# EasyEDA Pro project ProPrj_WashMech_V2.0_C011F6P6_2026-03-09.epro

# Schematic Schematic1
Assembly Variant: Basic; Board Name: Board1; Create Date: 2026-03-09; Page Name: P1; Project Name: WashMech_V2.0_C011F6P6; Schematic Name: Schematic1; Update Date: 2026-03-09; BladeWidth: 10; Company: 嘉立创EDA; Page Size: A4; RegionStart: 1; ShowBorder: 1; TitleBlock: 1; TitleBlockPosition: 3; Version: V1.0; XRegionCount: 6; YRegionCount: 4
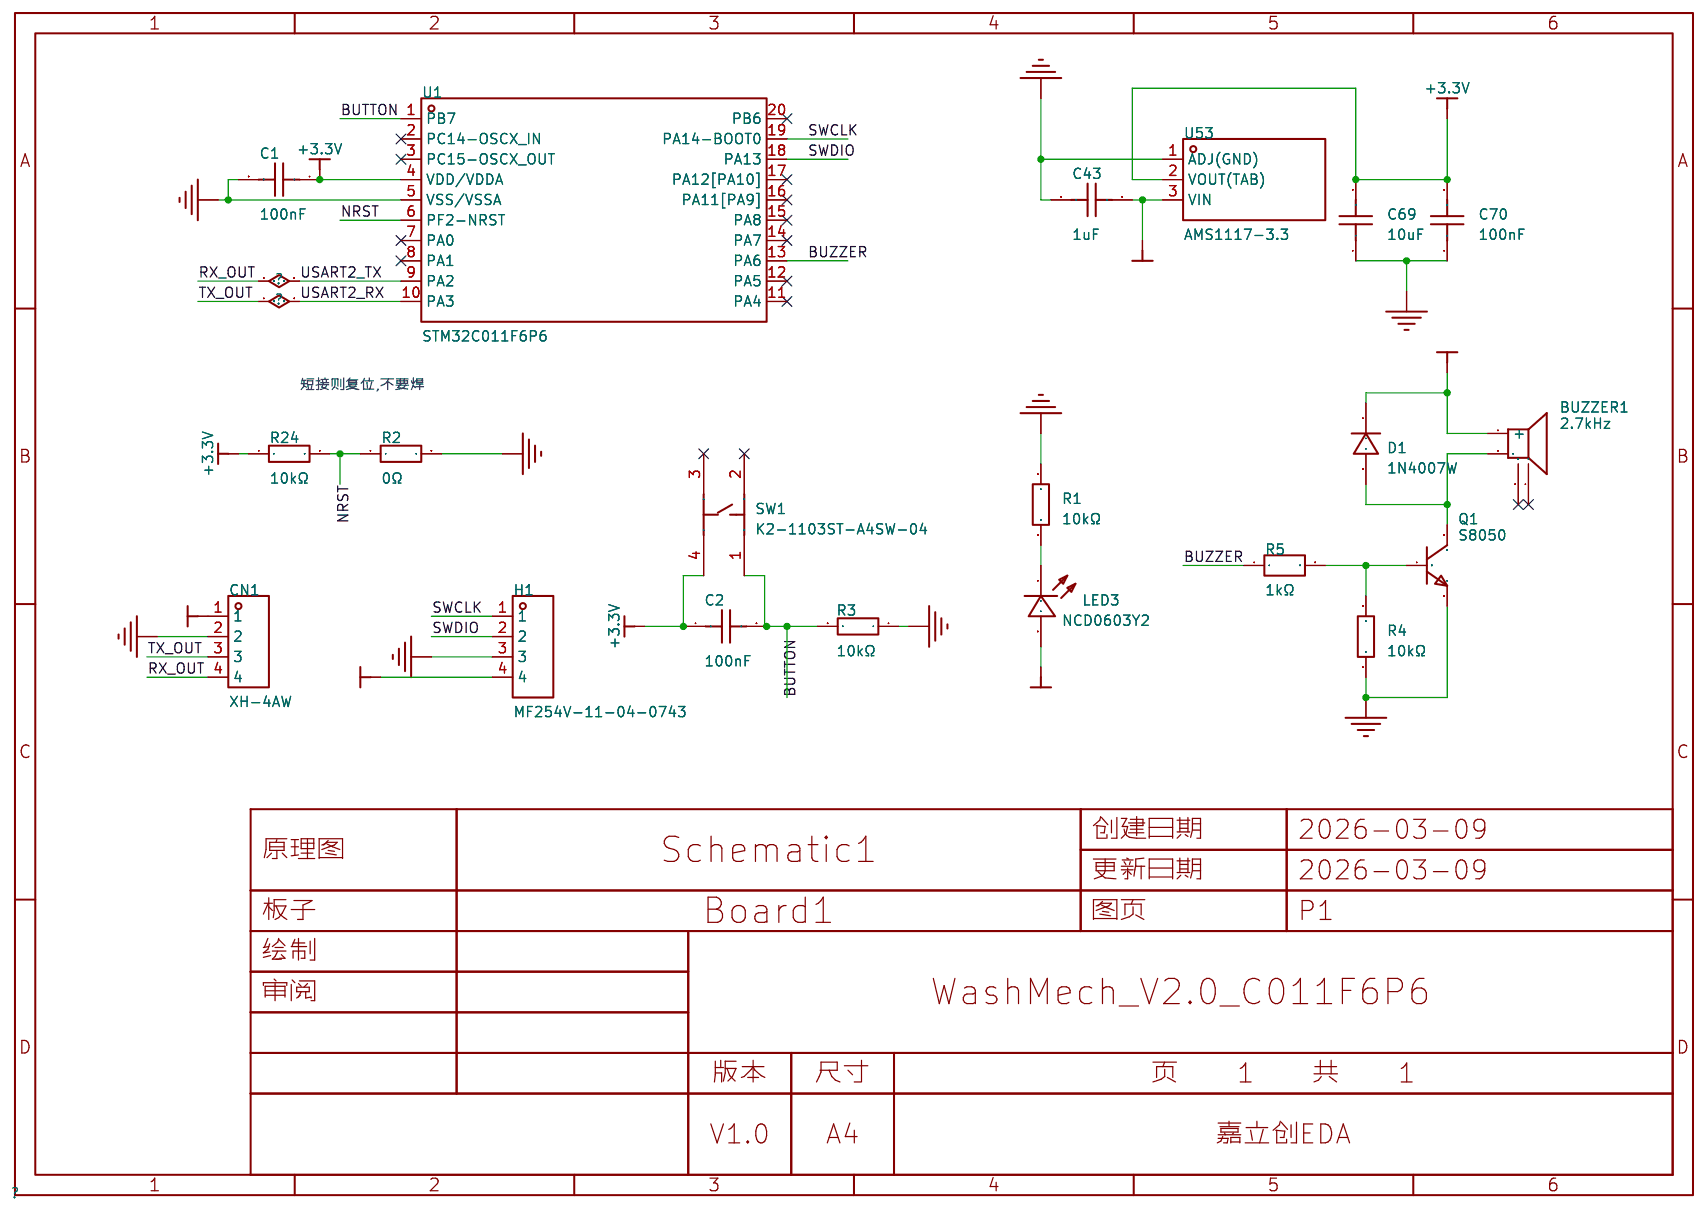
[diagram p0: schematic sheet]

## Parts
BUZZER1  2.7kHz  [BUZ-SMD_4P-L8.5-W8.5-P8.50-BR]
C1  100nF  [C0603]
C2  100nF  [C0603]
C43  1uF  [C0603]
C69  10uF  [C0603]
C70  100nF  [C0603]
CN1  XH-4AW  [CONN-TH_XH-4AW]
D1  1N4007W  [SOD-123FL_L2.7-W1.8-LS3.8-RD]
H1  MF254V-11-04-0743  [HDR-TH_4P-P2.54-V-F_MF254V-11-04-0743]
LED3  NCD0603Y2  [LED0603-RD]
Q1  S8050  [SOT-23-3_L2.9-W1.3-P1.90-LS2.3-BR]
R1  10kΩ  [R0603]
R2  0Ω  [R0603]
R3  10kΩ  [R0603]
R4  10kΩ  [R0603]
R5  1kΩ  [R0603]
R24  10kΩ  [R0603]
SW1  K2-1103ST-A4SW-04  [KEY-SMD_4P-L12.0-W12.0-P5.00-LS15.1_K2-1103ST-A4SW-04]
U1  STM32C011F6P6  [TSSOP-20_L6.5-W4.4-P0.65-LS6.4-BL]
U53  AMS1117-3.3  [SOT-89_L4.5-W2.5-P1.50-LS4.2-BR]

## Library data of the parts
BUZZER1 = MLT-8530_C94599: 驱动方式:无源(外部驱动);构造类型:电磁式;额定电压:3.6V;频率:2.7kHz;声压(SPL):80dB;; LCSC Part Name: 无源(外部驱动) 电磁式 2.7kHz; Supplier Part: C94599; Manufacturer: 华能; Manufacturer Part: MLT-8530; Supplier Footprint: SMD,8.5x8.5mm; JLCPCB Part Class: Extended Part; Datasheet: https://item.szlcsc.com/datasheet/MLT-8530/95797.html; Supplier: LCSC; Driver Circuitry: 无源(外部驱动); Technology: 电磁式; Voltage Rating: 3.6V; Voltage - Supply: 2.5V~4.5V; Current Consumption: 95mA; Sound Pressure Level(SPL): 80dB; Length: 8.5mm; Width: 8.5mm; Height: 3.3mm; Operating Temperature: -20℃~+70℃; Mounting Type: 贴片
C1 C2 C70 = CC0603KRX7R9BB104: 容值:100nF;精度:±10%;额定电压:50V;材质(温度系数):X7R;; LCSC Part Name: 100nF ±10% 50V; Supplier Part: C14663; Manufacturer: YAGEO(国巨); Supplier Footprint: 0603; JLCPCB Part Class: 基础库; Datasheet: https://atta.szlcsc.com/upload/public/pdf/source/20180910/C282072_33301C7F631E79921B82A8DAC6BCC5B3.pdf; Supplier: LCSC; Tolerance: ±10%; Voltage Rated: 50V; Temperature Coefficient: X7R
C43 = CL10A105KB8NNNC: 容值:1uF;精度:±10%;额定电压:50V;材质(温度系数):X5R;; LCSC Part Name: 1uF ±10% 50V; Supplier Part: C15849; Manufacturer: SAMSUNG(三星); Supplier Footprint: 0603; JLCPCB Part Class: 基础库; Datasheet: https://atta.szlcsc.com/upload/public/pdf/source/20160218/1457707763339.pdf; Supplier: LCSC; Tolerance: ±10%; Voltage Rated: 50V; Temperature Coefficient: X5R
C69 = CGA0603X5R106K100JT: 容值:10uF;精度:±10%;额定电压:10V;材质(温度系数):X5R;; LCSC Part Name: 10uF ±10% 10V; Supplier Part: C6119842; Manufacturer: HRE(芯声); Supplier Footprint: 0603; JLCPCB Part Class: 扩展库; Datasheet: https://item.szlcsc.com/datasheet/CGA0603X5R106K100JT/7062548.html; Supplier: LCSC; Tolerance: ±10%; Voltage Rating: 10V; Temperature Coefficient: X5R; Voltage Rated: 10V
CN1 = XH-4AW: 插针结构:1x4P;间距:2.54mm;安装方式:弯插;参考系列:XH;总PIN数:4P;排数:1;每排PIN数:4;行距:-;额定电流:3A;触头材质:黄铜;触头镀层:锡;工作温度:-25℃~+85℃;; LCSC Part Name: 1x4P 间距:2.54mm 弯插 系列:XH; Supplier Part: C2908613; Manufacturer: HCTL(华灿天禄); Supplier Footprint: 弯插,P=2.5mm; JLCPCB Part Class: Extended Part; Datasheet: https://item.szlcsc.com/datasheet/XH-4AW/3184384.html; Supplier: LCSC; Pins Structure: 1x4P; Pitch: 2.54mm; Mounting Type: 弯插; Reference Series: XH; Number of Pins: 4P; Number of Rows: 1; Number of PINs Per Row: 4; Current Rating: 3A; Contact Material: 黄铜; Contact Plating: 锡; Operating Temperature: -25℃~+85℃; Voltage Rating: 250V; Plastic Material: PA66; Flame Retardant Rating: UL94V-0; Z-Height of the Board: 5.9mm; Y-Width of Bottom Edge on Board: 7mm
D1 = 1N4007W_C18199088: 二极管配置:独立式;正向压降(Vf):1V@1.0A;直流反向耐压(Vr):1kV;整流电流:1A;; LCSC Part Name: 1kV 1A; Supplier Part: C18199088; Manufacturer: R+O(宏嘉诚); Supplier Footprint: SOD-123FL; JLCPCB Part Class: Extended Part; Datasheet: https://item.szlcsc.com/datasheet/1N4007W/19354320.html; Supplier: LCSC; Diode Configuration: 独立式; Voltage - Forward(Vf@If): 1V@1.0A; Voltage - DC Reverse(Vr): 1kV; Current - Rectified: 1A; Reverse Leakage Current (Ir): 2uA@1000V; Non-Repetitive Peak Forward Surge Current: 30A; Operating Junction Temperature Range: -55℃~+150℃
H1 = MF254V-11-04-0743: 插孔结构:1x4P;间距:2.54mm;行距:-;圆孔/方孔:圆孔;安装方式:直插;排数:单排;总孔位数:4P;额定电流:3A;额定电压:-;插孔方向:顶部;塑高:3mm;工作温度:-40℃~+105℃;; LCSC Part Name: 间距:2.54mm 1x4P 直插; Supplier Part: C2889986; Manufacturer: XFCN(兴飞); Supplier Footprint: 插件,P=2.54mm; JLCPCB Part Class: Extended Part; Datasheet: https://item.szlcsc.com/datasheet/MF254V-11-04-0743/3112799.html; Supplier: LCSC; Holes Structure: 1x4P; Pitch: 2.54mm; Circular Hole / Square Hole: 圆孔; Mounting Type: 直插; Number of Rows: 单排; Number of Positions: 4P; Current Rating: 3A; Holes Direction: 顶部; Insulation Height: 3mm; Operating Temperature: -40℃~+105℃
LED3 = NCD0603Y2: 发光颜色:黄色;正向电压(VF):1.6V~2.6V;功率:65mW;正向电流:20mA;主波长:586nm~595nm;透镜颜色:无色透明透镜;发光强度:100mcd~220mcd;发光角度:130°;工作温度:-30℃~+85℃;; Supplier Part: C89811; Manufacturer: 国星光电; Supplier Footprint: 0603; JLCPCB Part Class: 扩展库; Datasheet: https://atta.szlcsc.com/upload/public/pdf/source/20200820/C89811_7FE84B429B6BCA3E113B125EE1452576.pdf; Supplier: LCSC; Emitted Color: 黄色; Forward Voltage (VF): 1.6V~2.6V; Power Dissipation: 65mW; Forward Current: 20mA; Dominant Wavelength: 586nm~595nm; Lens Color: 无色透明透镜; Luminous Intensity: 100mcd~220mcd; Viewing Angle: 130°; Operating Temperature: -30℃~+85℃
Q1 = S8050_C20069125: 晶体管类型:NPN;集电极电流(Ic):500mA;集射极击穿电压(Vceo):25V;耗散功率(Pd):300mW;直流电流增益(hFE):120@50mA,1.0V;; LCSC Part Name: hFE:200-350，丝印:J3Y NPN 500mA 25V; Supplier Part: C20069125; Manufacturer: R+O(宏嘉诚); Supplier Footprint: SOT-23; JLCPCB Part Class: Extended Part; Datasheet: https://item.szlcsc.com/datasheet/S8050/21397163.html; Supplier: LCSC; type: NPN; Current - Collector(Ic): 500mA; Collector - Emitter Voltage VCEO: 25V; Pd - Power Dissipation: 300mW; DC Current Gain: 120@50mA,1.0V; Transition frequency(fT): 100MHz; Current - Collector Cutoff: 100nA; Vce Saturation(VCE(sat)): 600mV@500mA,50mA; Operating Temperature: -55℃~+150℃; Emitter-Base Voltage(Vebo): 5V
R1 R3 R24 = 0603WAF1002T5E: 电阻类型:厚膜电阻;阻值:10kΩ;精度:±1%;功率:100mW;最大工作电压:75V;温度系数:±100ppm/℃;; LCSC Part Name: 厚膜电阻 10kΩ ±1% 100mW; Supplier Part: C25804; Manufacturer: UNI-ROYAL(厚声); Supplier Footprint: 0603; JLCPCB Part Class: Basic Part; Datasheet: https://atta.szlcsc.com/upload/public/pdf/source/20200306/C422600_1E6D84923E4A46A82E41ADD87F860B5C.pdf; Supplier: LCSC; Type: 厚膜电阻; Tolerance: ±1%; Power(Watts): 100mW; Voltage-Supply(Max): 75V; Temperature Coefficient: ±100ppm/℃; Operating Temperature: -55℃~+155℃; Overload Voltage (Max): 75V; Operating Temperature Range: -55℃~+155℃
R2 = RC0603FR-070RL: 电阻类型:厚膜电阻;阻值:0Ω;精度:±1%;功率:100mW;工作电压:75V;温度系数:-;; LCSC Part Name: 厚膜电阻 0Ω ±1% 100mW; Supplier Part: C100044; Manufacturer: YAGEO(国巨); Supplier Footprint: 0603; JLCPCB Part Class: Extended Part; Datasheet: https://item.szlcsc.com/datasheet/RC0603FR-070RL/101258.html; Supplier: LCSC; Type: 厚膜电阻; Tolerance: ±1%; Power(Watts): 100mW; Voltage-Supply(Max): 75V; Operating Temperature: -55℃~+155℃
R4 = 0603WAF1002T5E: 电阻类型:厚膜电阻;阻值:10kΩ;精度:±1%;功率:100mW;工作电压:75V;温度系数:±100ppm/℃;; LCSC Part Name: 厚膜电阻 10kΩ ±1% 100mW; Supplier Part: C25804; Manufacturer: UNI-ROYAL(厚声); Supplier Footprint: 0603; JLCPCB Part Class: Basic Part; Datasheet: https://item.szlcsc.com/datasheet/0603WAF1002T5E/26547.html; Supplier: LCSC; Type: 厚膜电阻; Tolerance: ±1%; Power(Watts): 100mW; Voltage-Supply(Max): 75V; Temperature Coefficient: ±100ppm/℃; Operating Temperature: -55℃~+155℃
R5 = FRC0603F1001TS: 电阻类型:厚膜电阻;阻值:1kΩ;精度:±1%;功率:100mW;工作电压:75V;温度系数:±100ppm/℃;; LCSC Part Name: 1kΩ ±1% 100mW 厚膜电阻; Supplier Part: C2907002; Manufacturer: FOJAN(富捷); Supplier Footprint: 0603; JLCPCB Part Class: Extended Part; Supplier: LCSC; Type: 厚膜电阻; Tolerance: ±1%; Power(Watts): 100mW; Voltage-Supply(Max): 75V; Temperature Coefficient: ±100ppm/℃; Operating Temperature: -55℃~+155℃
SW1 = K2-1103ST-A4SW-04: 电路结构:单刀单掷;按钮形状:矩形按钮;作用力:2.5N;安装方式:立贴;开关长度:12mm;开关宽度:12mm;开关高度:7.3mm;带支架:不带支架;触点电流:50mA;额定电压:12V;带灯:无;工作寿命:10万次;; LCSC Part Name: 12x12x7.3方柄贴片高寿命; Supplier Part: C879472; Manufacturer: 韩国韩荣; Supplier Footprint: SMD-4P,12x12mm; JLCPCB Part Class: Extended Part; Datasheet: https://item.szlcsc.com/datasheet/K2-1103ST-A4SW-04/940369.html; Supplier: LCSC; Circuit: 单刀单掷; Actuator Style: 矩形按钮; Operating Force: 2.5N; Mounting Type: 立贴; Length: 12mm; Width: 12mm; Switch Height: 7.3mm; with Bracket: 不带支架; Contact Current: 50mA; Voltage Rating: 12V; With Lamp: 无; Termination Style: 鸥翼型; Life: 10万次; Operating Temperature: -25℃~+85℃
U1 = STM32C011F6P6: 特性：核心：32位Cortex-M0+ CPU，频率高达48 MHz。工作温度：-40℃至85℃ / 105℃ / 125℃。内存：高达32 KB带保护的闪存，6 KB带硬件奇偶校验的SRAM。CRC计算单元。复位和电源管理：电压范围2.0 V至3.6 V，具备上电/掉电复位（POR/PDR）、可编程欠压复位（BOR），低功耗模式包括睡眠、停止、待机、关机。时钟管理：4至48 MHz晶体振荡器，32 kHz带校准的晶体振荡器，内部48 MHz RC振荡器（±1%），内部32 kHz RC振荡器（±5%）; LCSC Part Name: Arm Cortex-M0+ 32位微控制器，32 KB闪存，6 KB RAM，2个通用同步异步收发器（USART），定时器，模数转换器（ADC），通信接口，工作电压2-3.6 V; Supplier Part: C5456198; Manufacturer: ST(意法半导体); Supplier Footprint: TSSOP-20; JLCPCB Part Class: Extended Part; Datasheet: https://item.szlcsc.com/datasheet/STM32C011F6P6/6367613.html; Supplier: LCSC
U53 = AMS1117-3.3_C347256: 输出类型:固定;工作电压:18V;输出电压:3.3V;输出电流:1A;电源纹波抑制比(PSRR):60dB@(120Hz);输出极性:正极;; LCSC Part Name: 输出:3.3V 电流:1A 耐压:18V; Supplier Part: C347256; Manufacturer: UMW(友台半导体); Supplier Footprint: SOT-89; JLCPCB Part Class: 扩展库; Datasheet: https://atta.szlcsc.com/upload/public/pdf/source/20241218/BAF0263FA2E44BCD8AF41AA4FA04EFAA.pdf; Supplier: LCSC; Output Type: 固定; Voltage - Supply: 18V; Output Voltage: 3.3V; Output Current: 1A; Power Supply Rejection Ratio (PSRR): 60dB@(120Hz); Voltage Dropout: 1.3V@(1A); Features: 过流保护(OCP); Output Configuration: 正极; Number of Outputs: 1

## Nets
+3.3V: C1.1 C2.1 C69.2 C70.2 H1.4 LED3.2(A) R24.1 SW1.4 U1.4(VDD/VDDA) U53.2(VOUT(TAB))
+5V: BUZZER1.1(+) C43.1 CN1.1 D1.1(K) U53.3(VIN)
GND: C1.2 C43.2 C69.1 C70.1 CN1.2 H1.3 Q1.2(E) R1.1 R2.2 R3.1 R4.1 U1.5(VSS/VSSA) U53.1(ADJ(GND))
BUTTON: C2.2 R3.2 SW1.1 U1.1(PB7)
BUZZER: R5.1 U1.13(PA6)
NRST: R2.1 R24.2 U1.6(PF2-NRST)
RX_OUT: CN1.4 U1.9(PA2)
SWCLK: H1.1 U1.19(PA14-BOOT0)
SWDIO: H1.2 U1.18(PA13)
TX_OUT: CN1.3 U1.10(PA3)
$1N10: LED3.1(K) R1.2
$1N41: Q1.1(B) R4.2 R5.2
$1N43: BUZZER1.2 D1.2(A) Q1.3(C)

Not connected (* = marked no-connect by the designer): BUZZER1 3* 4*; SW1 2* 3*; U1 2(PC14-OSCX_IN)* 3(PC15-OSCX_OUT)* 7(PA0)* 8(PA1)* 11(PA4)* 12(PA5)* 14(PA7)* 15(PA8)* 16(PA11[PA9])* 17(PA12[PA10])* 20(PB6)*

## Notes on the sheet
- 短接则复位,不要焊

# Board PCB1
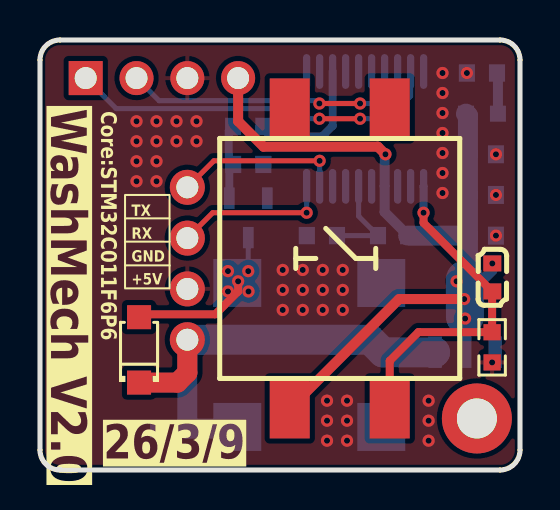
[diagram p1: board, top side]
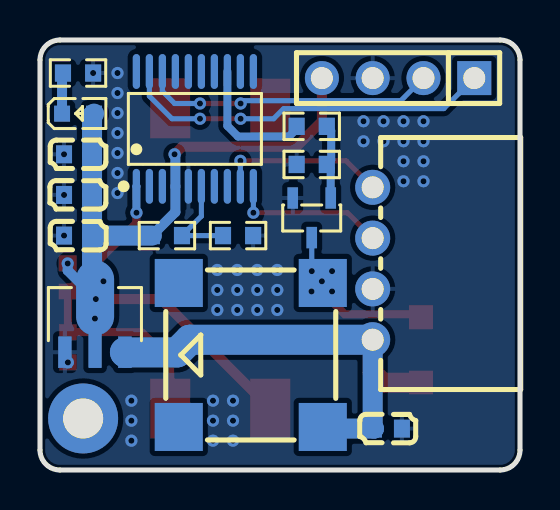
[diagram p2: board, bottom side, seen from below]

Outline 24 x 21.5 mm; copper layers: Top Layer, Bottom Layer. Coordinates in mm from the lower left corner of the outline.
Outline path: 0,20.5 0,1 arc(0.29,0.29) 1,0 23,0 arc(23.71,0.29) 24,1 24,20.5 arc(23.71,21.21) 23,21.5 1,21.5 arc(0.29,21.21) 0,20.5
Stack: Top Layer 0.035mm / Dielectric1 1.51mm FR4 er 4.5 / Bottom Layer 0.035mm

## Design rules (mm)
spacing copperThickness1oz (default): track to track 0.102, other pairs 0.152 to 0.3
spacing copperThickness2oz: track to track 0.203, other pairs 0.152 to 0.3
track width copperThickness1oz (default): min 0.127, default 0.254, max 2.54
track width copperThickness2oz: min 0.203, default 0.254, max 2.54
differential pair differentialPair (default): width min 0.127, default 0.254, max 2.54; gap min 0.152, default 0.152
net GND uses copperRegion

## Placement (name value [footprint] x y rotation side)
BUZZER1  2.7kHz  [BUZ-SMD_4P-L8.5-W8.5-P8.50-BR]  13.46 5.75 90 bottom
C1  100nF  [C0603]  22.1 11.72 0 bottom
C2  100nF  [C0603]  22.62 9.63 270 top
C43  1uF  [C0603]  6.6 2.07 180 bottom
C69  10uF  [C0603]  22.1 15.78 180 bottom
C70  100nF  [C0603]  22.1 13.75 180 bottom
CN1  XH-4AW  [CONN-TH_XH-4AW]  7.37 10.32 90 bottom
D1  1N4007W  [SOD-123FL_L2.7-W1.8-LS3.8-RD]  4.95 6.01 90 top
H1  MF254V-11-04-0743  [HDR-TH_4P-P2.54-V-F_MF254V-11-04-0743]  6.1 19.59 0 bottom
LED3  NCD0603Y2  [LED0603-RD]  22.1 17.82 180 bottom
NOREF  -  [Pad_e57]  21.84 2.58 0 top
Q1  S8050  [SOT-23-3_L2.9-W1.3-P1.90-LS2.3-BR]  10.41 12.61 90 bottom
R1  10kΩ  [R0603]  22.1 19.85 0 bottom
R2  0Ω  [R0603]  14.1 11.72 180 bottom
R3  10kΩ  [R0603]  22.61 6.13 90 top
R4  10kΩ  [R0603]  10.41 15.28 180 bottom
R5  1kΩ  [R0603]  10.41 17.18 180 bottom
R24  10kΩ  [R0603]  17.65 11.72 180 bottom
SW1  K2-1103ST-A4SW-04  [KEY-SMD_4P-L12.0-W12.0-P5.00-LS15.1_K2-1103ST-A4SW-04]  14.99 10.58 90 top
U1  STM32C011F6P6  [TSSOP-20_L6.5-W4.4-P0.65-LS6.4-BL]  16.26 17.06 180 bottom
U53  AMS1117-3.3  [SOT-89_L4.5-W2.5-P1.50-LS4.2-BR]  21.25 7.25 270 bottom

## Footprints (pads in the part's own frame, mm; a bottom-side part is the same pattern mirrored in y, then rotated)
BUZ-SMD_4P-L8.5-W8.5-P8.50-BR
  rect 2.4x2.4 smd: 1(-3.6,-3.6) 2(3.6,-3.6) 3(3.599,3.599) 4(-3.6,3.6)
C0603
  rect 0.8x0.9 smd: 1(-0.7,0) 2(0.7,0)
CONN-TH_XH-4AW
  round 1.75 hole 1.1: 1(-3.81,0) 2(-1.27,0) 3(1.27,0) 4(3.81,0)
HDR-TH_4P-P2.54-V-F_MF254V-11-04-0743
  rect 1.7x1.7 hole 1.1: 1(-3.81,0)
  round 1.7 hole 1.1: 2(-1.27,0) 3(1.27,0) 4(3.81,0)
KEY-SMD_4P-L12.0-W12.0-P5.00-LS15.1_K2-1103ST-A4SW-04
  rect 3x2 smd: 1(-7.5,-2.5) 2(7.5,-2.5) 3(7.5,2.5) 4(-7.5,2.5)
LED0603-RD
  rect 0.8x0.8 smd: 1(-0.799,0) 2(0.799,0)
Pad_e57
  round 3.5 hole 2: 1(0,0)
R0603
  rect 0.806x0.864 smd: 1(-0.753,0) 2(0.753,0)
SOD-123FL_L2.7-W1.8-LS3.8-RD
  rect 1.2x1.2 smd: 1(-1.635,0) 2(1.635,0)
SOT-23-3_L2.9-W1.3-P1.90-LS2.3-BR
  rect 1.07x0.532 smd: 1(0.99,-0.95) 2(0.99,0.95) 3(-0.99,0)
SOT-89_L4.5-W2.5-P1.50-LS4.2-BR
  rect 1.575x0.672 smd: 1(1.356,-1.5) 3(1.356,1.5)
  custom 5.377x1.9 smd: 2(-1.356,0.009)
TSSOP-20_L6.5-W4.4-P0.65-LS6.4-BL
  oval 0.364x1.742 smd: 1(-2.925,-2.871) 2(-2.275,-2.871) 3(-1.625,-2.871) 4(-0.975,-2.871) 5(-0.325,-2.871) 6(0.325,-2.871) 7(0.975,-2.871) 8(1.625,-2.871) 9(2.275,-2.871) 10(2.925,-2.871) 11(2.925,2.871) 12(2.275,2.871) 13(1.625,2.871) 14(0.975,2.871) 15(0.325,2.871) 16(-0.325,2.871) 17(-0.975,2.871) 18(-1.625,2.871) 19(-2.275,2.871) 20(-2.925,2.871)

## Nets
As in the schematic.

Pads without a net: BUZZER1 3 4; NOREF 1; SW1 2 3; U1 2 3 7 8 11 12 14 15 16 17 20

## Via types
v1: diameter 0.61, hole 0.305, Top Layer to Bottom Layer, 62 vias

## Routing (per net, layer and track width the routed paths; a pad name or vN(x,y) marks a point on that pad's centre or on a via; arc(x,y) is an arc through that point)
+3.3V: length 40.1
  Top Layer w0.5: SW1.4 17.95,8.55 v1(21.21,8.55) ; H1.4 9.91,17.44 11.18,16.17 16.89,16.17 v1(17.27,15.78)
  Bottom Layer w0.5: R24.1 17.23,12.9 U1.4 17.23,15.74 v1(17.27,15.78) ; v1(22.62,10.33) 22.62,9.97 21.4,8.76
  Bottom Layer w1: C1.1 C70.2 C69.2 21.4,17.72 LED3.2 ; C1.1 21.4,8.76 U53.2 ; C1.1 R24.1
  vias: v1(20.83,9.44) v1(21.25,7.57)
+5V: length 24
  Top Layer w1: CN1.1 7.37,4.86 6.87,4.37 D1.1
  Bottom Layer w1: BUZZER1.1 9.78,2.07 C43.1 7.37,2.13 CN1.1
  Bottom Layer w1.5: CN1.1 16.51,6.51 17.15,5.88 19.74,5.88 U53.3
GND:
  vias: v1(4.83,17.44) v1(4.83,16.44) v1(4.83,15.44) v1(4.83,14.44) v1(5.83,17.44) v1(5.83,16.44) v1(5.83,15.44) v1(5.83,14.44) v1(6.83,17.44) v1(6.83,16.44) v1(7.83,17.44) v1(7.83,16.44) v1(12.14,10) v1(12.14,9) v1(12.14,8) v1(13.14,10) v1(13.14,9) v1(13.14,8) v1(14.14,10) v1(14.14,9) v1(14.14,8) v1(14.35,3.47) v1(14.35,2.47) v1(14.35,1.47) v1(15.14,10) v1(15.14,9) v1(15.14,8) v1(15.35,3.47) v1(15.35,2.47) v1(15.35,1.47) v1(19.43,3.47) v1(19.43,2.47) v1(19.43,1.47) v1(20.13,19.85) v1(20.13,18.85) v1(20.13,17.85) v1(20.13,16.85) v1(20.13,15.85) v1(20.13,14.85) v1(20.13,13.85) v1(21.34,19.85) v1(22.61,5.38) v1(22.8,15.78) v1(22.8,13.75) v1(22.8,11.72)
BUTTON: length 16.8
  Top Layer w0.4: SW1.1 17.49,5.46 18.92,6.89 22.6,6.89 R3.2 22.61,8.92 22.62,8.93 22.61,8.93 19.18,12.36 v1(19.18,12.86)
  Bottom Layer w0.4: v1(19.18,12.86) 19.18,14.18 U1.1
BUZZER: length 6.7
  Bottom Layer w0.4: U1.13 14.63,17.21 14.1,16.67 11.55,16.67 11.17,17.06 R5.1
NRST: length 4.9
  Bottom Layer w0.254: U1.6 15.93,12.69 R24.2 R2.1
RX_OUT: length 8.4
  Top Layer w0.254: CN1.4 8.69,15.46 v1(13.98,15.46)
  Bottom Layer w0.254: U1.9 v1(13.98,15.46)
SWCLK: length 18.8
  Top Layer w0.254: v1(16,17.56) v1(13.97,17.56)
  Bottom Layer w0.254: v1(16,17.56) 17.4,17.56 18.53,18.69 U1.19 ; H1.1 3.81,18.07 11.81,18.07 12.32,17.56 v1(13.97,17.56)
SWDIO: length 14.8
  Top Layer w0.254: v1(16,18.33) v1(13.97,18.33)
  Bottom Layer w0.254: v1(16,18.33) 17.27,18.33 17.88,18.93 U1.18 ; v1(13.97,18.33) 13.83,18.47 5.96,18.47 H1.2
TX_OUT: length 7.8
  Top Layer w0.254: v1(13.33,12.86) 8.64,12.86 CN1.3
  Bottom Layer w0.254: U1.10 v1(13.33,12.86)
$1N10: length 2.1
  Bottom Layer w0.5: LED3.1 22.9,19.8 R1.2
$1N41: length 3.8
  Bottom Layer w0.4: Q1.1 9.46,15.08 R4.2 9.44,15.5 9.44,16.96 R5.2
$1N43: length 7.7
  Top Layer w0.4: D1.2 5.1,7.78 8.76,7.78 9.91,8.93 v1(9.91,9.44)
  Bottom Layer w0.254: Q1.3 10.41,11.62 v1(10.41,9.94)
  vias: v1(9.4,9.94) v1(9.4,8.93) v1(10.42,8.93)

## Copper pours and planes (outline as drawn; the poured copper is in the pictures)
GND on Top Layer: -2.16,22.77 24.64,22.77 24.64,-0.22 -2.16,-0.22
GND on Bottom Layer: -1.02,22.14 25.15,22.14 25.15,-0.72 -1.02,-0.72

## Text on the board
Top Silkscreen Layer: TX | RX | GND | +5V | Core:STM32C011F6P6 | 26/3/9 | WashMech V2.0
